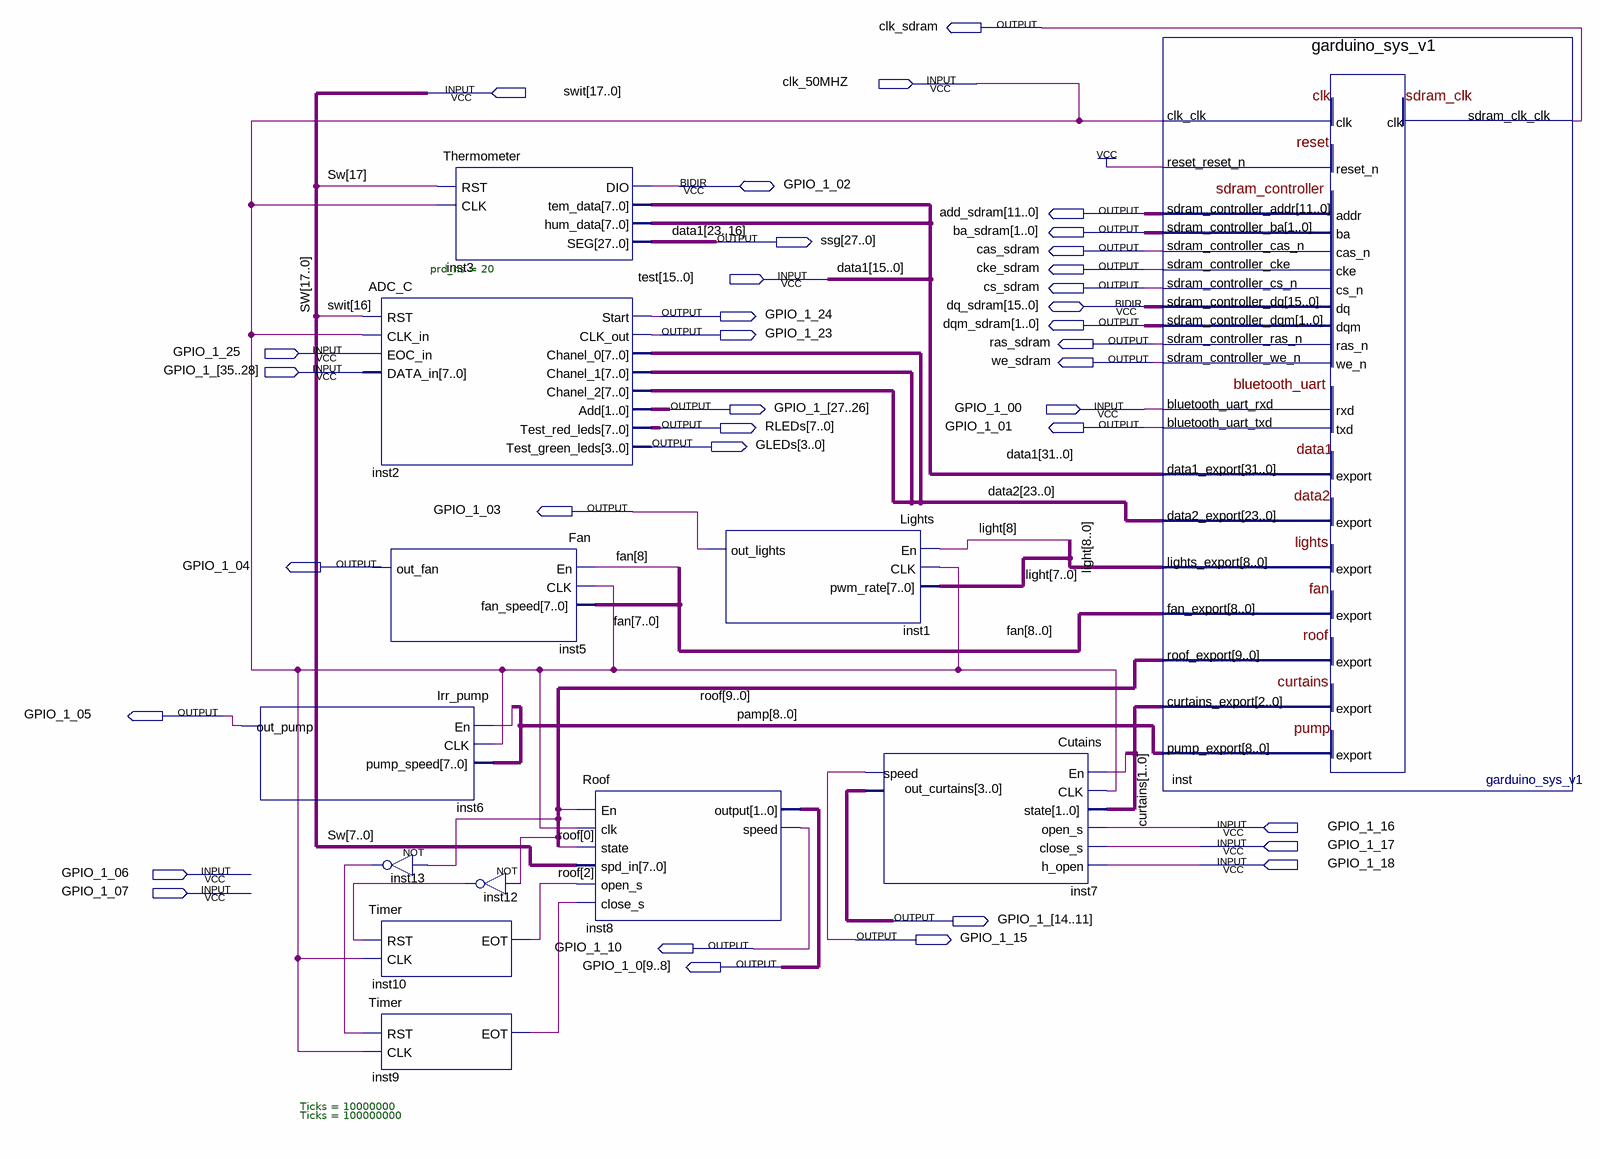
[diagram p0: schematic sheet]
// Quartus schematic Graduino_v1.bdf as structural Verilog: 12 symbols, 36 pins
module Graduino_v1 (
  input  clk_50MHZ,
  input  [17:0] swit,
  input  [15:0] test,
  input  GPIO_1_25,
  inout  [35:11] GPIO_1_,
  input  GPIO_1_00,
  input  GPIO_1_16,
  input  GPIO_1_17,
  input  GPIO_1_18,
  input  GPIO_1_06,
  input  GPIO_1_07,
  inout  GPIO_1_02,
  inout  [15:0] dq_sdram,
  output clk_sdram,
  output [11:0] add_sdram,
  output [1:0] ba_sdram,
  output [27:0] ssg,
  output cas_sdram,
  output cke_sdram,
  output cs_sdram,
  output GPIO_1_24,
  output [1:0] dqm_sdram,
  output GPIO_1_23,
  output ras_sdram,
  output we_sdram,
  output [7:0] RLEDs,
  output GPIO_1_01,
  output [3:0] GLEDs,
  output GPIO_1_03,
  output GPIO_1_04,
  output GPIO_1_05,
  output GPIO_1_15,
  output GPIO_1_10,
  output [9:8] GPIO_1_0
);

  wire inst9_eot, inst12_out, inst13_out;
  wire [2:0] curtains;
  wire [8:0] fan, light, pamp;
  wire [9:0] roof;
  wire [23:0] data2;
  wire [31:16] data1;

  Irr_pump inst6 (.En(pamp[8]), .CLK(clk_50MHZ), .pump_speed(pamp[7:0]), .out_pump(GPIO_1_05));
  ADC_C inst2 (
    .RST(swit[16]), .CLK_in(clk_50MHZ), .EOC_in(GPIO_1_25), .DATA_in(GPIO_1_[35:28]), .Start(GPIO_1_24),
    .CLK_out(GPIO_1_23), .Chanel_0(data2[7:0]), .Chanel_1(data2[15:8]), .Chanel_2(data2[23:16]),
    .Add(GPIO_1_[27:26]), .Test_red_leds(RLEDs), .Test_green_leds(GLEDs));
  Fan inst5 (.En(fan[8]), .CLK(clk_50MHZ), .fan_speed(fan[7:0]), .out_fan(GPIO_1_04));
  not inst13 (inst13_out, roof[3]);
  Timer #(.Ticks(10000000)) inst10 (.RST(inst12_out), .CLK(clk_50MHZ), .EOT(roof[2]));
  Timer #(.Ticks(100000000)) inst9 (.RST(inst13_out), .CLK(clk_50MHZ), .EOT(inst9_eot));
  Thermometer #(.prd_ns(20)) inst3 (
    .RST(swit[17]), .CLK(clk_50MHZ), .tem_data(data1[31:24]), .hum_data(data1[23:16]), .SEG(ssg),
    .DIO(GPIO_1_02));
  not inst12 (inst12_out, roof[2]);
  Roof inst8 (
    .En(roof[1]), .clk(clk_50MHZ), .state(roof[0]), .spd_in(swit[7:0]), .open_s(roof[2]),
    .close_s(inst9_eot), .\output (GPIO_1_0), .speed(GPIO_1_10));
  Lights inst1 (.En(light[8]), .CLK(clk_50MHZ), .pwm_rate(light[7:0]), .out_lights(GPIO_1_03));
  Cutains inst7 (
    .En(curtains[2]), .CLK(clk_50MHZ), .state(curtains[1:0]), .open_s(GPIO_1_16), .close_s(GPIO_1_17),
    .h_open(GPIO_1_18), .speed(GPIO_1_15), .out_curtains(GPIO_1_[14:11]));
  garduino_sys_v1 inst (
    .clk_clk(clk_50MHZ), .reset_reset_n(1'b1), .bluetooth_uart_rxd(GPIO_1_00), .data1_export({data1, test}),
    .data2_export(data2), .sdram_controller_addr(add_sdram), .sdram_controller_ba(ba_sdram),
    .sdram_controller_cas_n(cas_sdram), .sdram_controller_cke(cke_sdram), .sdram_controller_cs_n(cs_sdram),
    .sdram_controller_dqm(dqm_sdram), .sdram_controller_ras_n(ras_sdram), .sdram_controller_we_n(we_sdram),
    .bluetooth_uart_txd(GPIO_1_01), .sdram_clk_clk(clk_sdram), .lights_export(light), .fan_export(fan),
    .roof_export(roof), .curtains_export(curtains), .pump_export(pamp), .sdram_controller_dq(dq_sdram));

  // Other names for the same wires on the sheet: data1[15:0] = test; Sw[17:0] = swit
endmodule
